# Altium schematic sheet SCH_SEGEMENTOS_MINUTERO_1.SchDoc: TP Final - Reloj - Display Minuto 1
size A4; Author: Luciano Lopez; CompanyName: UTN - FRBA; Revision: 1; SheetNumber: 7; SheetTotal: 10
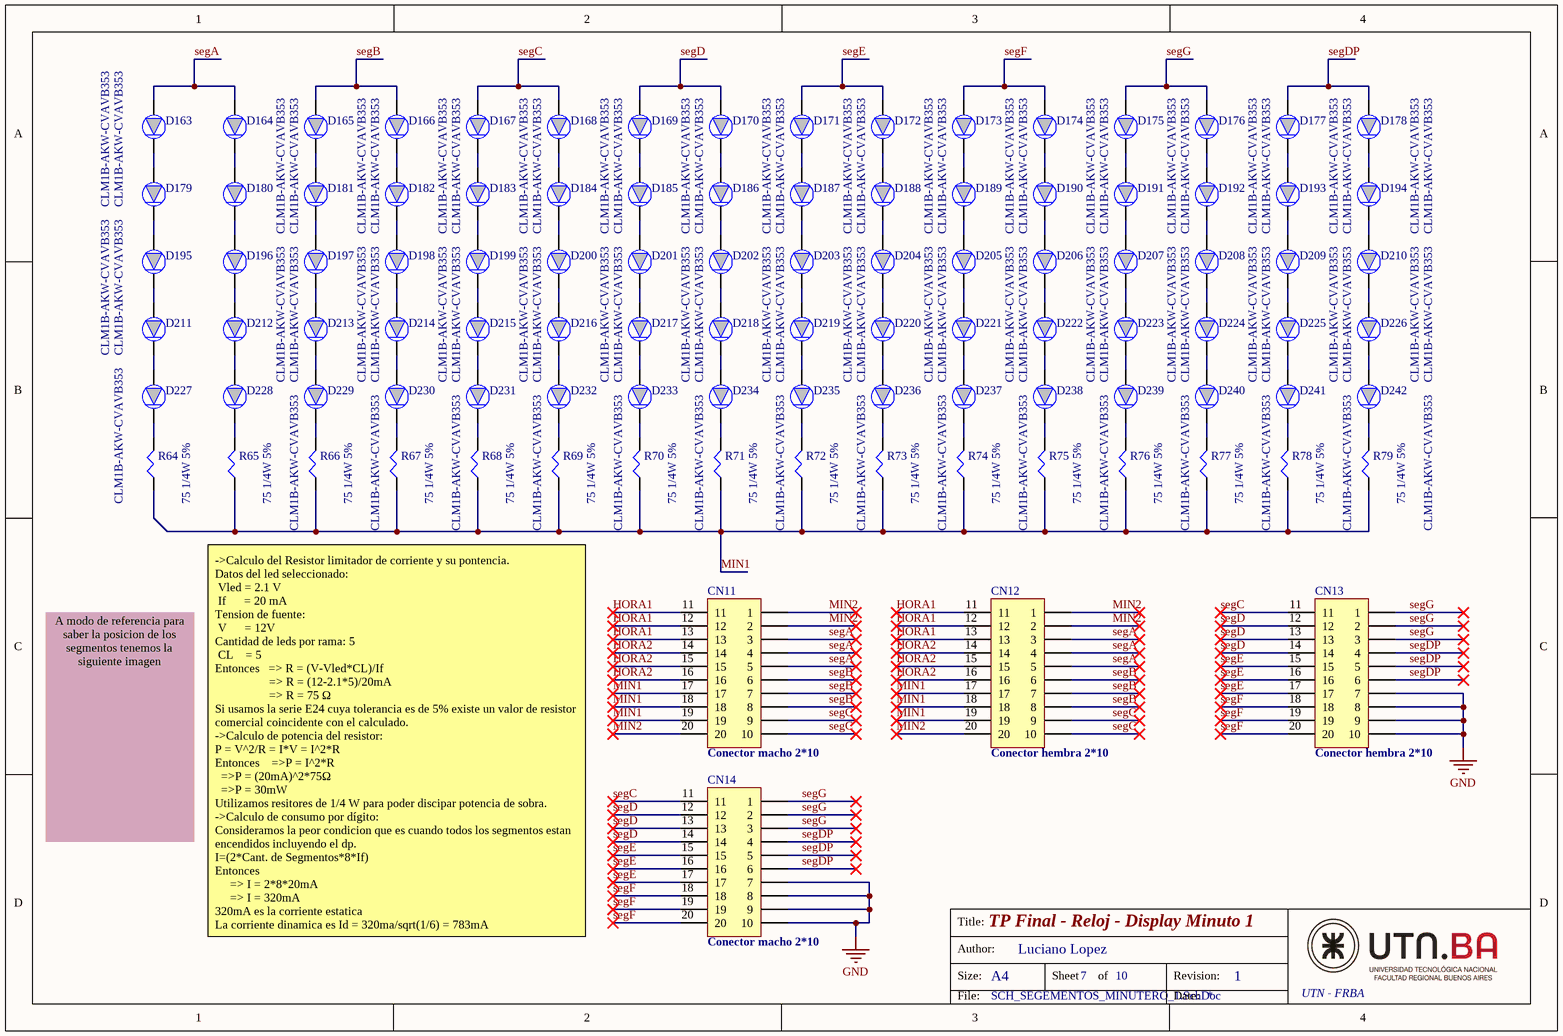
[diagram p0: SCH_SEGEMENTOS_MINUTERO_1.SchDoc]

## Parts
CN11  Conector macho 2*10
CN12  Conector hembra 2*10
CN13  Conector hembra 2*10
CN14  Conector macho 2*10
D163  CLM1B-AKW-CVAVB353  [PLCC2_LED]
D164  CLM1B-AKW-CVAVB353  [PLCC2_LED]
D165  CLM1B-AKW-CVAVB353  [PLCC2_LED]
D166  CLM1B-AKW-CVAVB353  [PLCC2_LED]
D167  CLM1B-AKW-CVAVB353  [PLCC2_LED]
D168  CLM1B-AKW-CVAVB353  [PLCC2_LED]
D169  CLM1B-AKW-CVAVB353  [PLCC2_LED]
D170  CLM1B-AKW-CVAVB353  [PLCC2_LED]
D171  CLM1B-AKW-CVAVB353  [PLCC2_LED]
D172  CLM1B-AKW-CVAVB353  [PLCC2_LED]
D173  CLM1B-AKW-CVAVB353  [PLCC2_LED]
D174  CLM1B-AKW-CVAVB353  [PLCC2_LED]
D175  CLM1B-AKW-CVAVB353  [PLCC2_LED]
D176  CLM1B-AKW-CVAVB353  [PLCC2_LED]
D177  CLM1B-AKW-CVAVB353  [PLCC2_LED]
D178  CLM1B-AKW-CVAVB353  [PLCC2_LED]
D179  CLM1B-AKW-CVAVB353  [PLCC2_LED]
D180  CLM1B-AKW-CVAVB353  [PLCC2_LED]
D181  CLM1B-AKW-CVAVB353  [PLCC2_LED]
D182  CLM1B-AKW-CVAVB353  [PLCC2_LED]
D183  CLM1B-AKW-CVAVB353  [PLCC2_LED]
D184  CLM1B-AKW-CVAVB353  [PLCC2_LED]
D185  CLM1B-AKW-CVAVB353  [PLCC2_LED]
D186  CLM1B-AKW-CVAVB353  [PLCC2_LED]
D187  CLM1B-AKW-CVAVB353  [PLCC2_LED]
D188  CLM1B-AKW-CVAVB353  [PLCC2_LED]
D189  CLM1B-AKW-CVAVB353  [PLCC2_LED]
D190  CLM1B-AKW-CVAVB353  [PLCC2_LED]
D191  CLM1B-AKW-CVAVB353  [PLCC2_LED]
D192  CLM1B-AKW-CVAVB353  [PLCC2_LED]
D193  CLM1B-AKW-CVAVB353  [PLCC2_LED]
D194  CLM1B-AKW-CVAVB353  [PLCC2_LED]
D195  CLM1B-AKW-CVAVB353  [PLCC2_LED]
D196  CLM1B-AKW-CVAVB353  [PLCC2_LED]
D197  CLM1B-AKW-CVAVB353  [PLCC2_LED]
D198  CLM1B-AKW-CVAVB353  [PLCC2_LED]
D199  CLM1B-AKW-CVAVB353  [PLCC2_LED]
D200  CLM1B-AKW-CVAVB353  [PLCC2_LED]
D201  CLM1B-AKW-CVAVB353  [PLCC2_LED]
D202  CLM1B-AKW-CVAVB353  [PLCC2_LED]
D203  CLM1B-AKW-CVAVB353  [PLCC2_LED]
D204  CLM1B-AKW-CVAVB353  [PLCC2_LED]
D205  CLM1B-AKW-CVAVB353  [PLCC2_LED]
D206  CLM1B-AKW-CVAVB353  [PLCC2_LED]
D207  CLM1B-AKW-CVAVB353  [PLCC2_LED]
D208  CLM1B-AKW-CVAVB353  [PLCC2_LED]
D209  CLM1B-AKW-CVAVB353  [PLCC2_LED]
D210  CLM1B-AKW-CVAVB353  [PLCC2_LED]
D211  CLM1B-AKW-CVAVB353  [PLCC2_LED]
D212  CLM1B-AKW-CVAVB353  [PLCC2_LED]
D213  CLM1B-AKW-CVAVB353  [PLCC2_LED]
D214  CLM1B-AKW-CVAVB353  [PLCC2_LED]
D215  CLM1B-AKW-CVAVB353  [PLCC2_LED]
D216  CLM1B-AKW-CVAVB353  [PLCC2_LED]
D217  CLM1B-AKW-CVAVB353  [PLCC2_LED]
D218  CLM1B-AKW-CVAVB353  [PLCC2_LED]
D219  CLM1B-AKW-CVAVB353  [PLCC2_LED]
D220  CLM1B-AKW-CVAVB353  [PLCC2_LED]
D221  CLM1B-AKW-CVAVB353  [PLCC2_LED]
D222  CLM1B-AKW-CVAVB353  [PLCC2_LED]
D223  CLM1B-AKW-CVAVB353  [PLCC2_LED]
D224  CLM1B-AKW-CVAVB353  [PLCC2_LED]
D225  CLM1B-AKW-CVAVB353  [PLCC2_LED]
D226  CLM1B-AKW-CVAVB353  [PLCC2_LED]
D227  CLM1B-AKW-CVAVB353  [PLCC2_LED]
D228  CLM1B-AKW-CVAVB353  [PLCC2_LED]
D229  CLM1B-AKW-CVAVB353  [PLCC2_LED]
D230  CLM1B-AKW-CVAVB353  [PLCC2_LED]
D231  CLM1B-AKW-CVAVB353  [PLCC2_LED]
D232  CLM1B-AKW-CVAVB353  [PLCC2_LED]
D233  CLM1B-AKW-CVAVB353  [PLCC2_LED]
D234  CLM1B-AKW-CVAVB353  [PLCC2_LED]
D235  CLM1B-AKW-CVAVB353  [PLCC2_LED]
D236  CLM1B-AKW-CVAVB353  [PLCC2_LED]
D237  CLM1B-AKW-CVAVB353  [PLCC2_LED]
D238  CLM1B-AKW-CVAVB353  [PLCC2_LED]
D239  CLM1B-AKW-CVAVB353  [PLCC2_LED]
D240  CLM1B-AKW-CVAVB353  [PLCC2_LED]
D241  CLM1B-AKW-CVAVB353  [PLCC2_LED]
D242  CLM1B-AKW-CVAVB353  [PLCC2_LED]
R64  75 1/4W 5%  [R_0805]
R65  75 1/4W 5%  [R_0805]
R66  75 1/4W 5%  [R_0805]
R67  75 1/4W 5%  [R_0805]
R68  75 1/4W 5%  [R_0805]
R69  75 1/4W 5%  [R_0805]
R70  75 1/4W 5%  [R_0805]
R71  75 1/4W 5%  [R_0805]
R72  75 1/4W 5%  [R_0805]
R73  75 1/4W 5%  [R_0805]
R74  75 1/4W 5%  [R_0805]
R75  75 1/4W 5%  [R_0805]
R76  75 1/4W 5%  [R_0805]
R77  75 1/4W 5%  [R_0805]
R78  75 1/4W 5%  [R_0805]
R79  75 1/4W 5%  [R_0805]

## Nets
GND: CN13.7 CN13.8 CN13.9 CN13.10 CN14.7 CN14.8 CN14.9 CN14.10
HORA1: CN11.11 CN11.12 CN11.13 CN12.11 CN12.12 CN12.13
HORA2: CN11.14 CN11.15 CN11.16 CN12.14 CN12.15 CN12.16
MIN1: CN11.17 CN11.18 CN11.19 CN12.17 CN12.18 CN12.19 R64.47 R65.47 R66.47 R67.47 R68.47 R69.47 R70.47 R71.47 R72.47 R73.47 R74.47 R75.47 R76.47 R77.47 R78.47 R79.47
MIN2: CN11.1 CN11.2 CN11.20 CN12.1 CN12.2 CN12.20
segA: CN11.3 CN11.4 CN11.5 CN12.3 CN12.4 CN12.5 D163.12 D164.12
segB: CN11.6 CN11.7 CN11.8 CN12.6 CN12.7 CN12.8 D165.12 D166.12
segC: CN11.9 CN11.10 CN12.9 CN12.10 CN13.11 CN14.11 D167.12 D168.12
segD: CN13.12 CN13.13 CN13.14 CN14.12 CN14.13 CN14.14 D169.12 D170.12
segDP: CN13.4 CN13.5 CN13.6 CN14.4 CN14.5 CN14.6 D177.12 D178.12
segE: CN13.15 CN13.16 CN13.17 CN14.15 CN14.16 CN14.17 D171.12 D172.12
segF: CN13.18 CN13.19 CN13.20 CN14.18 CN14.19 CN14.20 D173.12 D174.12
segG: CN13.1 CN13.2 CN13.3 CN14.1 CN14.2 CN14.3 D175.12 D176.12
NetD163_11: D163.11 D179.12
NetD164_11: D164.11 D180.12
NetD165_11: D165.11 D181.12
NetD166_11: D166.11 D182.12
NetD167_11: D167.11 D183.12
NetD168_11: D168.11 D184.12
NetD169_11: D169.11 D185.12
NetD170_11: D170.11 D186.12
NetD171_11: D171.11 D187.12
NetD172_11: D172.11 D188.12
NetD173_11: D173.11 D189.12
NetD174_11: D174.11 D190.12
NetD175_11: D175.11 D191.12
NetD176_11: D176.11 D192.12
NetD177_11: D177.11 D193.12
NetD178_11: D178.11 D194.12
NetD179_11: D179.11 D195.12
NetD180_11: D180.11 D196.12
NetD181_11: D181.11 D197.12
NetD182_11: D182.11 D198.12
NetD183_11: D183.11 D199.12
NetD184_11: D184.11 D200.12
NetD185_11: D185.11 D201.12
NetD186_11: D186.11 D202.12
NetD187_11: D187.11 D203.12
NetD188_11: D188.11 D204.12
NetD189_11: D189.11 D205.12
NetD190_11: D190.11 D206.12
NetD191_11: D191.11 D207.12
NetD192_11: D192.11 D208.12
NetD193_11: D193.11 D209.12
NetD194_11: D194.11 D210.12
NetD195_11: D195.11 D211.12
NetD196_11: D196.11 D212.12
NetD197_11: D197.11 D213.12
NetD198_11: D198.11 D214.12
NetD199_11: D199.11 D215.12
NetD200_11: D200.11 D216.12
NetD201_11: D201.11 D217.12
NetD202_11: D202.11 D218.12
NetD203_11: D203.11 D219.12
NetD204_11: D204.11 D220.12
NetD205_11: D205.11 D221.12
NetD206_11: D206.11 D222.12
NetD207_11: D207.11 D223.12
NetD208_11: D208.11 D224.12
NetD209_11: D209.11 D225.12
NetD210_11: D210.11 D226.12
NetD211_11: D211.11 D227.12
NetD212_11: D212.11 D228.12
NetD213_11: D213.11 D229.12
NetD214_11: D214.11 D230.12
NetD215_11: D215.11 D231.12
NetD216_11: D216.11 D232.12
NetD217_11: D217.11 D233.12
NetD218_11: D218.11 D234.12
NetD219_11: D219.11 D235.12
NetD220_11: D220.11 D236.12
NetD221_11: D221.11 D237.12
NetD222_11: D222.11 D238.12
NetD223_11: D223.11 D239.12
NetD224_11: D224.11 D240.12
NetD225_11: D225.11 D241.12
NetD226_11: D226.11 D242.12
NetD227_11: D227.11 R64.48
NetD228_11: D228.11 R65.48
NetD229_11: D229.11 R66.48
NetD230_11: D230.11 R67.48
NetD231_11: D231.11 R68.48
NetD232_11: D232.11 R69.48
NetD233_11: D233.11 R70.48
NetD234_11: D234.11 R71.48
NetD235_11: D235.11 R72.48
NetD236_11: D236.11 R73.48
NetD237_11: D237.11 R74.48
NetD238_11: D238.11 R75.48
NetD239_11: D239.11 R76.48
NetD240_11: D240.11 R77.48
NetD241_11: D241.11 R78.48
NetD242_11: D242.11 R79.48

## Notes on the sheet
- A modo de referencia para saber la posicion de los segmentos tenemos la siguiente imagen
- ->Calculo del Resistor limitador de corriente y su pontencia.
  Datos del led seleccionado:
  Vled = 2.1 V
  If      = 20 mA
  Tension de fuente:
  V      = 12V
  Cantidad de leds por rama: 5
  CL    = 5
  Entonces   => R = (V-Vled*CL)/If
  => R = (12-2.1*5)/20mA
  => R = 75 Ω
  Si usamos la serie E24 cuya tolerancia es de 5% existe un valor de resistor comercial coincidente con el calculado.
  ->Calculo de potencia del resistor:
  P = V^2/R = I*V = I^2*R
  Entonces    =>P = I^2*R
  =>P = (20mA)^2*75Ω
  =>P = 30mW
  Utilizamos resitores de 1/4 W para poder discipar potencia de sobra.
  ->Calculo de consumo por dígito:
  Consideramos la peor condicion que es cuando todos los segmentos estan encendidos incluyendo el dp.
  I=(2*Cant. de Segmentos*8*If)
  Entonces
  => I = 2*8*20mA
  => I = 320mA
  320mA es la corriente estatica
  La corriente dinamica es Id = 320ma/sqrt(1/6) = 783mA
- Title:
- Size:
- Author:
- A4
- Sheet
- of
- Revision:
- File:
- Date:

## Library data of the parts
CN11-CN14 = CONN_2x10P: Connector Generic 10 Vias
D163-D242 = LED_DIODE
R64-R79 = Resistor